# EAGLE design water (EAGLE 8.2.0)
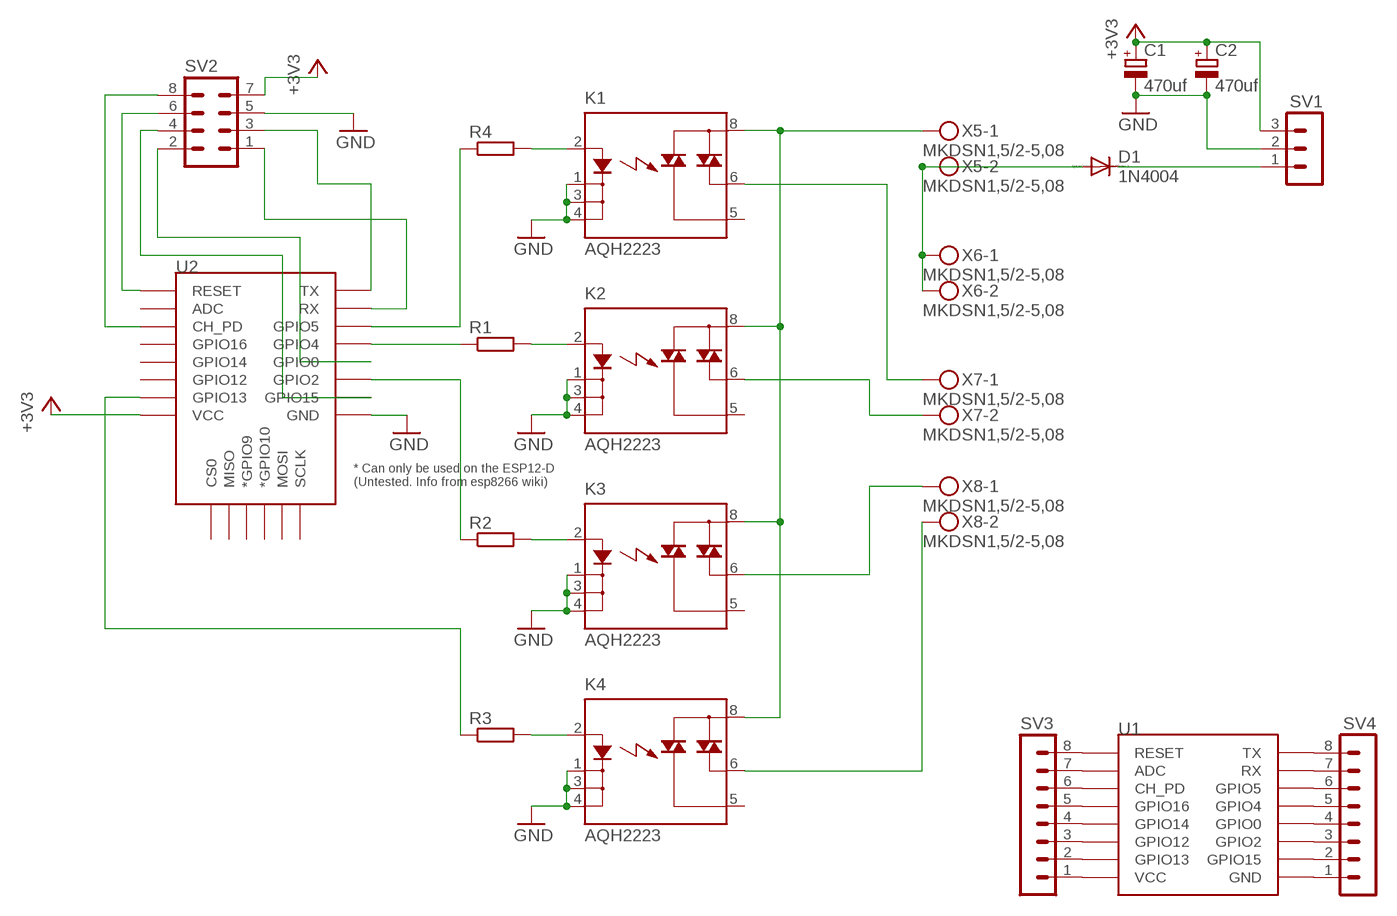
[diagram p0: schematic, sheet 1]

## Parts
C1  470uf  CPOL-EUE5-10.5  [E5-10,5]
C2  470uf  CPOL-EUE5-10.5  [E5-10,5]
D1  1N4004  [DO41-10]
K1  AQH2223  [DIL07]
K2  AQH2223  [DIL07]
K3  AQH2223  [DIL07]
K4  AQH2223  [DIL07]
R1  R-EU_R1206  [R1206]
R2  R-EU_R1206  [R1206]
R3  R-EU_R1206  [R1206]
R4  R-EU_R1206  [R1206]
SV1  MA03-1  [MA03-1]
SV2  MA04-2  [MA04-2]
SV3  MA08-1  [MA08-1]
SV4  MA08-1  [MA08-1]
U1  ESP12EPOGO  [ESP12E-POGO]
U2  ESP12ESMD  [ESP12E-SMD]
X5  MKDSN1,5/2-5,08  [MKDSN1,5/2-5,08]
X6  MKDSN1,5/2-5,08  [MKDSN1,5/2-5,08]
X7  MKDSN1,5/2-5,08  [MKDSN1,5/2-5,08]
X8  MKDSN1,5/2-5,08  [MKDSN1,5/2-5,08]

## Nets
+3V3: C1.+ C2.+ SV1.3 SV2.7 U2.VCC
GND: C1.- C2.- K1.1(K) K1.3(K1) K1.4(K2) K2.1(K) K2.3(K1) K2.4(K2) K3.1(K) K3.3(K1) K3.4(K2) K4.1(K) K4.3(K1) K4.4(K2) SV1.2 SV2.5 U2.GND
N$1: K1.2(A) R4.2
N$2: K2.2(A) R1.2
N$3: K3.2(A) R2.2
N$4: K4.2(A) R3.2
N$5: R4.1 U2.GPIO5
N$6: R1.1 U2.GPIO4
N$7: R2.1 U2.GPIO2
N$8: R3.1 U2.GPIO13
N$9: K4.6(DS3) X8.2
N$10: K3.6(DS3) X8.1
N$11: K2.6(DS3) X7.2
N$12: K1.6(DS3) X7.1
N$13: SV2.8 U2.CH_PD
N$14: D1.C SV1.1
N$15: D1.A X5.2 X6.1 X6.2
N$16: SV2.6 U2.RESET
N$17: SV2.3 U2.TXD0(TX)
N$18: SV2.1 U2.RXD0(RX)
N$19: SV2.4 U2.GPIO15
N$20: SV2.2 U2.GPIO0
N$21: K1.8(DS1) K2.8(DS1) K3.8(DS1) K4.8(DS1) X5.1
N$22: SV3.1 U1.VCC
N$23: SV3.2 U1.GPIO13
N$24: SV3.3 U1.GPIO12
N$25: SV3.4 U1.GPIO14
N$26: SV3.5 U1.GPIO16
N$27: SV3.6 U1.CH_PD
N$28: SV3.7 U1.ADC
N$29: SV3.8 U1.RESET
N$30: SV4.1 U1.GND
N$31: SV4.2 U1.GPIO15
N$32: SV4.3 U1.GPIO2
N$33: SV4.4 U1.GPIO0
N$34: SV4.5 U1.GPIO4
N$35: SV4.6 U1.GPIO5
N$36: SV4.7 U1.RXD0(RX)
N$37: SV4.8 U1.TXD0(TX)
Unconnected: K1.5(DS2) K2.5(DS2) K3.5(DS2) K4.5(DS2) U2.ADC U2.CS0 U2.GPIO9(*GPIO9) U2.GPIO10(*GPIO10) U2.GPIO12 U2.GPIO14 U2.GPIO16 U2.MISO U2.MOSI U2.SCLK

## Library data of the parts
C1 C2 = resistor:CPOL-EU: POLARIZED CAPACITOR, European symbol
D1 = diode:1N4004: DIODE general purpose rectifier, 1 A
K1-K4 = relay:AQH*223: SOLID STATE RELAY NAiS Source: http://www.mew-europe.com/.. en_ds_61613_0000.pdf; MF: AROMAT/ MATSUSHITA; MPN: AQH2223; OC_FARNELL: unknown; OC_NEWARK: 26K3059
R1-R4 = resistor:R-EU_: RESISTOR, European symbol
SV1 = con-lstb:MA03-1: PIN HEADER; OC_FARNELL: unknown; OC_NEWARK: unknown
SV2 = con-lstb:MA04-2: PIN HEADER; OC_FARNELL: unknown; OC_NEWARK: unknown
SV3 SV4 = con-lstb:MA08-1: PIN HEADER; OC_FARNELL: unknown; OC_NEWARK: unknown
U1 = my-parts:ESP12E: ESP12E Module
U2 = esp8266modules:ESP12E: ESP12E Module
X5-X8 = con-phoenix-508:MKDSN1,5/2-5,08: MKDSN 1,5/ 2-5,08 Printklemme Nennstrom: 13,5 A Nennspannung: 250 V Rastermaß: 5,08 mm Polzahl: 2 Anschlussart: Schraubanschluss Montage: Löten Anschlussrichtung Leiter/Platine: 0 ° Artikelnummer: 1729128 Source: http://eshop.phoenixcontact.com .. 1729128.pdf

## Board
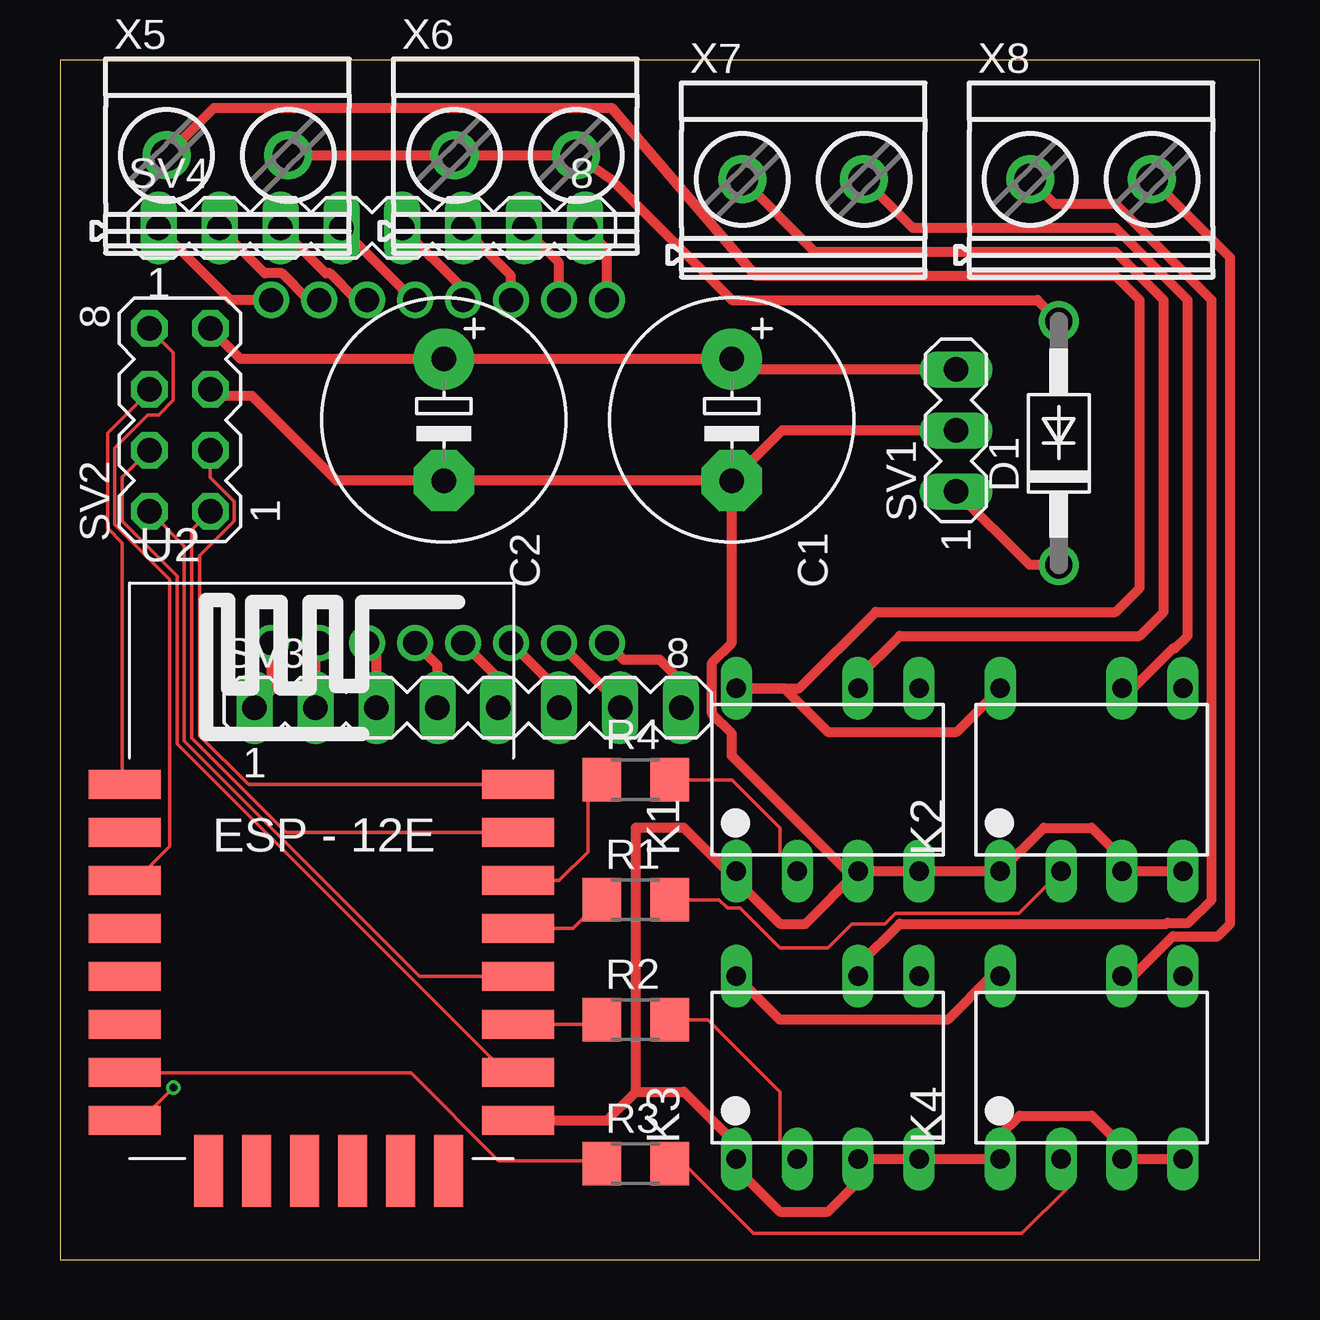
[diagram p1: board, top side]
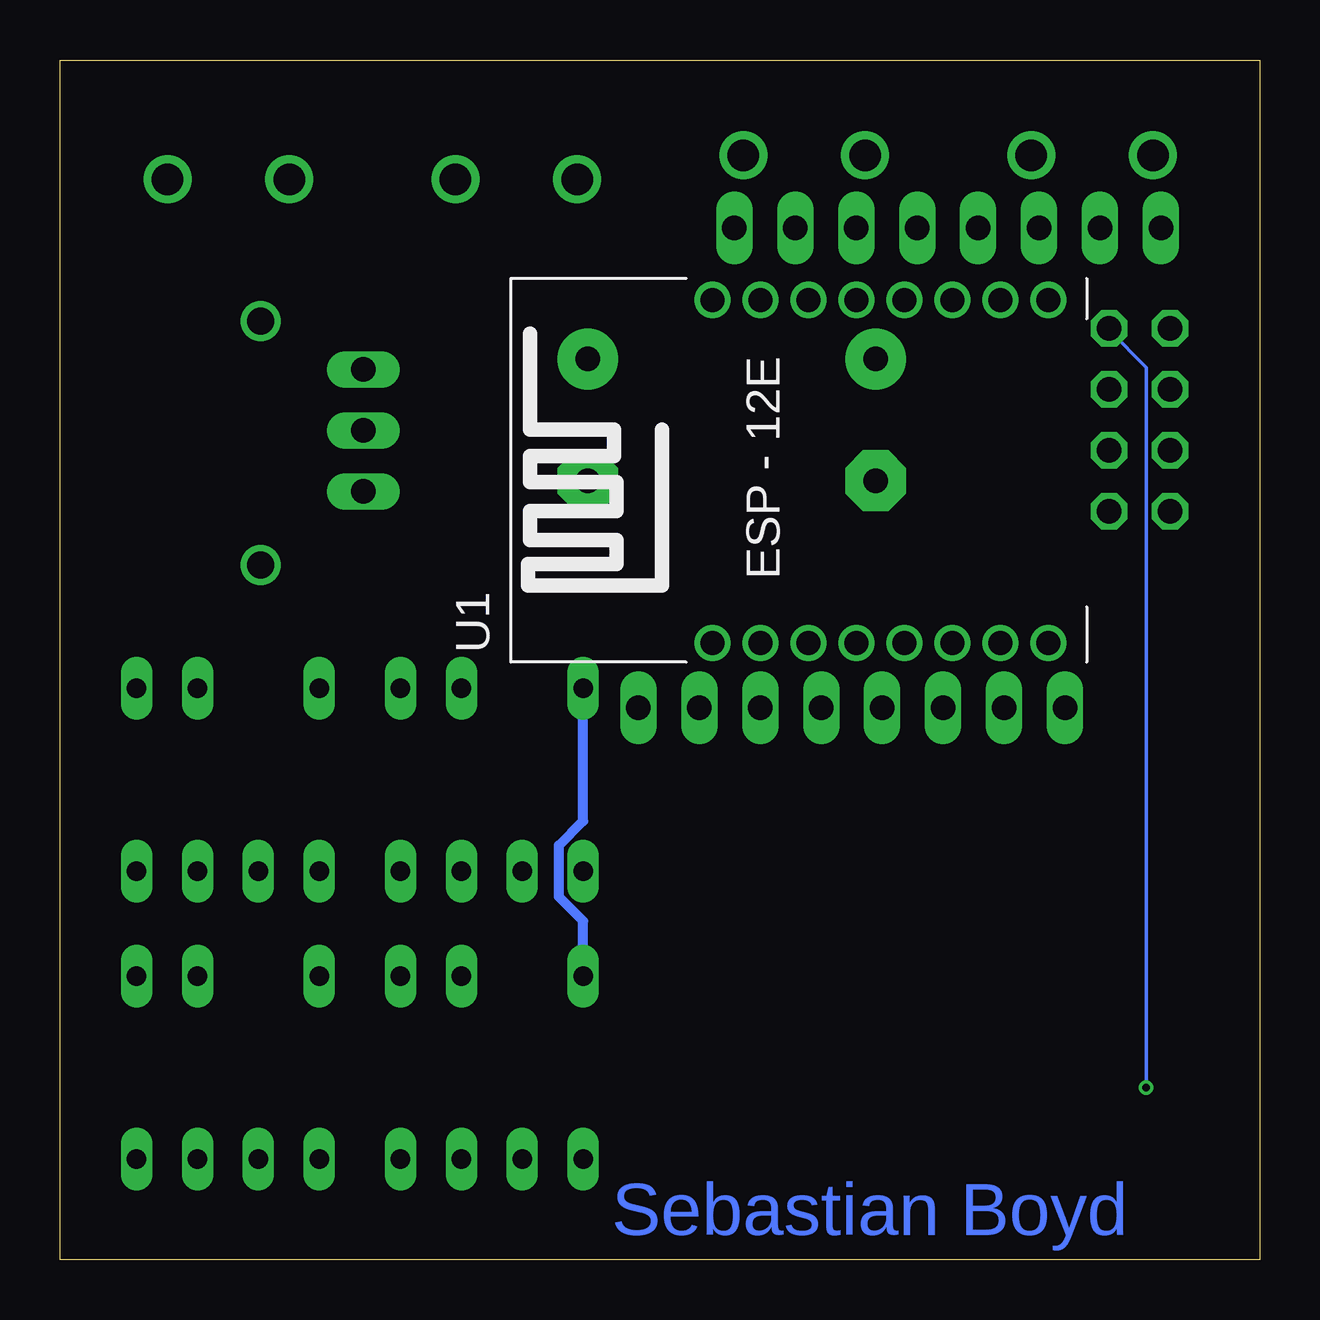
[diagram p2: board, bottom side, seen from below]

Size 50 x 50 mm. Coordinates in mm from the lower left corner, seen from the top.
Outline: 0,0 50,0 50,50 0,50 0,0
Copper layers (1*16): Top 0.035mm / dielectric 1.5mm / Bottom 0.035mm
Design rules "dirt_cheap_dirty_boards.v1": minimum track width 5mil, minimum drill 12mil, track to track 5mil, track to pad 5mil, pad to pad 5mil, via to via 5mil, smd to smd 0mil, copper to edge 10mil, drill to drill 10mil, minimum pad ring 10mil, minimum via ring 6mil, stop-mask expansion 2mil, vias tented up to drill 25mil, thermal gap 10mil

### Footprints (pad centres in the part's own frame; a part is rotated, then mirrored left to right if it is on the bottom)
E5-10,5 = drill 1.016 pad 2.54: + -2.54,0 | drill 1.016 pad 2.54 octagon: - 2.54,0
DO41-10 = drill 1.118: A 5.08,0; C -5.08,0
DIL07 = drill 0.8 long: 1 -3.81,-3.81; 2 -1.27,-3.81; 3 1.27,-3.81; 4 3.81,-3.81; 5 3.81,3.81; 6 1.27,3.81; 8 -3.81,3.81
R1206 = smd 1.6 x 1.803: 1 -1.422,0; 2 1.422,0
MA03-1 = drill 1.016 long: 1 -2.54,0; 2 0,0; 3 2.54,0
MA04-2 = drill 1.016 octagon: 1 -3.81,-1.27; 2 -3.81,1.27; 3 -1.27,-1.27; 4 -1.27,1.27; 5 1.27,-1.27; 6 1.27,1.27; 7 3.81,-1.27; 8 3.81,1.27
MA08-1 = drill 1.016 long: 1 -8.89,0; 2 -6.35,0; 3 -3.81,0; 4 -1.27,0; 5 1.27,0; 6 3.81,0; 7 6.35,0; 8 8.89,0
ESP12E-POGO = drill 1: ADC -7.3,3.8; CH_PD -7.3,1.8; GND 7,-8.2; GPIO0 7,-2.2; GPIO2 7,-4.2; GPIO4 7,-0.2; GPIO5 7,1.8; GPIO12 -7.3,-4.2; GPIO13 -7.3,-6.2; GPIO14 -7.3,-2.2; GPIO15 7,-6.2; GPIO16 -7.3,-0.2; RESET -7.3,5.8; RXD0 7,3.8; TXD0 7,5.8; VCC -7.3,-8.2
ESP12E-SMD = smd 3 x 1.2: ADC -8.3,3.8; CH_PD -8.3,1.8; GND 8.1,-8.2; GPIO0 8.1,-2.2; GPIO2 8.1,-4.2; GPIO4 8.1,-0.2; GPIO5 8.1,1.8; GPIO12 -8.3,-4.2; GPIO13 -8.3,-6.2; GPIO14 -8.3,-2.2; GPIO15 8.1,-6.2; GPIO16 -8.3,-0.2; RESET -8.3,5.8; RXD0 8.1,3.8; TXD0 8.1,5.8; VCC -8.3,-8.2 | smd 1.2 x 3: CS0 -4.8,-10.3; GPIO9 -0.8,-10.3; GPIO10 1.2,-10.3; MISO -2.8,-10.3; MOSI 3.2,-10.3; SCLK 5.2,-10.3
MKDSN1,5/2-5,08 = drill 1.3 pad 2: 1 -2.561,0.025; 2 2.519,0.025

### Placement (x,y rotation side)
C1  28,35 270 top
C2  16,35 270 top
D1  41.63,34.03 90 top
K1  32,20 0 top
K2  43,20 0 top
K3  32,8 0 top
K4  43,8 0 top
R1  24,15 0 top
R2  24,10 0 top
R3  24,4 0 top
R4  24,20 0 top
SV1  37.35,34.56 90 top
SV2  5,35 90 top
SV3  17,23 0 top
SV4  13,43 0 top
U1  17,33 90 bottom
U2  11,14 0 top
X5  7,46 0 top
X6  19,46 0 top
X7  31,45 0 top
X8  43,45 0 top

### Tracks (layer width: path | path; a pad name or v marks a point on that pad's centre or on a via)
+3V3  (via drill 0.3)
  Top 0.152: v4.72,7.16 3.5,5.94 2.74,5.94 U2.VCC
  Top 0.406: SV1.3 28.44,37.1 C1.+ C2.+ 7.54,37.54 SV2.7
  Bottom 0.152: v4.72,7.16 4.72,37.19 6.25,38.71 SV2.7
GND
  Top 0.406: K4.4 K4.3 44,4.46 44,5 43,6 40,6 39.19,5.19 K4.1 K3.4 K3.3 33,3.92 33,3 32,2 30,2 28.19,3.81 K3.1 28,4.38 28,5 26,7 24,7 | U2.GND 22.8,5.8 24,7 | 24,7 24,18 26,18 27.81,16.19 K1.1 28.19,15.81 30,14 31.08,14 K1.3 | K1.3 K1.4 K2.1 41,18 43,18 44,17 44,16.46 K2.3 K2.4 | SV1.2 30.1,34.56 C1.- | C1.- C2.- 11.54,32.46 8,36 6.54,36 SV2.5 | K1.3 32.81,16.19 31.15,17.85 28,21 28,21.92 27.18,22.74 27.18,24.88 28,25.7 C1.-
N$1
  Top 0.152: R4.2 28,20 30,18 30,16.92 K1.2
N$2
  Top 0.152: R1.2 27.48,15 27.82,14.65 28.35,14.65 30,13 32,13 33,14 34.39,14 34.82,14.43 39.97,14.43 K2.2
N$3
  Top 0.152: R2.2 27,10 30,7 30,4.92 K3.2
N$4
  Top 0.152: R3.2 26,4 28.91,1.09 40.09,1.09 42,3 42,3.92 K4.2
N$5
  Top 0.152: U2.GPIO5 20.8,15.8 22,17 22,19.42 R4.1
N$6
  Top 0.152: U2.GPIO4 21.38,13.8 R1.1
N$7
  Top 0.152: U2.GPIO2 22.38,9.8 R2.1
N$8
  Top 0.152: R3.1 22.55,4.12 18.29,4.12 14.63,7.77 2.74,7.77 U2.GPIO13
N$9
  Top 0.406: X8.2 48.78,41.76 48.78,14 48.25,13.47 46.39,13.47 44.73,11.81 K4.6
N$10
  Top 0.406: K3.6 33.27,12.27 35,14 46.13,14 46.16,14.03 47.03,14.03 48,15 48,40 44,44 41.46,44 X8.1
N$11
  Top 0.406: K2.6 44.73,23.81 46.39,25.47 46.47,25.47 47,26 47,40 44,43 35.54,43 X7.2
N$12
  Top 0.406: K1.6 33.27,24.27 35,26 45,26 46,27 46,40 44,42 31.46,42 X7.1
N$13
  Top 0.152: U2.CH_PD 2.74,15.85 3.2,15.85 4.57,17.22 4.57,28.35 2.29,30.63 2.29,33.83 3.66,35.2 4.12,35.2 4.72,35.81 4.72,37.8 3.81,38.71 SV2.8
N$14
  Top 0.406: D1.C 40.42,28.95 SV1.1
N$15
  Top 0.406: X5.2 X6.1 X6.2 22.98,45.02 28,40 40.74,40 D1.A
N$16
  Top 0.152: U2.RESET 2.59,19.81 2.59,29.87 1.98,30.48 1.98,34.44 3.66,36.12 SV2.6
N$17
  Top 0.152: U2.TXD0 7.86,19.8 5.83,21.83 5.83,29.35 7.26,30.78 7.26,31.6 6.27,32.59 SV2.3
N$18
  Top 0.152: U2.RXD0 9.43,17.8 5.49,21.74 5.49,30.41 SV2.1
N$19
  Top 0.152: U2.GPIO15 19.05,7.92 18.44,7.92 4.88,21.49 4.88,28.5 2.59,30.79 2.59,32.61 3.66,33.68 SV2.4
N$20
  Top 0.152: 18.44,11.89 19.05,11.89 U2.GPIO0 15,11.8 5.18,21.61 5.18,29.74 SV2.2
N$21
  Top 0.406: K2.8 37.38,22 32,22 30.19,23.81 K1.8 30.81,23.81 34,27 44,27 45,28 45,40 44,41 29,41 23,48 6.41,48 X5.1 | K4.8 38.81,11.81 37,10 30,10 K3.8
  Bottom 0.406: K3.8 28.19,14.11 29.2,15.12 29.2,17.26 28.19,18.27 K1.8
N$22
  Top 0.406: U1.VCC 8.8,23.69 SV3.1
N$23
  Top 0.406: SV3.2 10.65,25.55 U1.GPIO13
N$24
  Top 0.406: SV3.3 13.19,25.31 U1.GPIO12
N$25
  Top 0.406: SV3.4 15.73,24.77 U1.GPIO14
N$26
  Top 0.406: SV3.5 18.27,24.23 U1.GPIO16
N$27
  Top 0.406: SV3.6 20.81,23.69 U1.CH_PD
N$28
  Top 0.406: SV3.7 23.35,23.15 U1.ADC
N$29
  Top 0.406: SV3.8 25.89,24.11 25,25 23.5,25 U1.RESET
N$30
  Top 0.406: U1.GND 7.11,40 SV4.1
N$31
  Top 0.406: SV4.2 8.54,41.11 9.26,41.11 10.37,40 U1.GPIO15
N$32
  Top 0.406: SV4.3 11.08,41.11 11.26,41.11 12.37,40 U1.GPIO2
N$33
  Top 0.406: U1.GPIO0 14.73,40 SV4.4
N$34
  Top 0.406: U1.GPIO4 16.8,40.47 SV4.5
N$35
  Top 0.406: U1.GPIO5 18.8,41.01 SV4.6
N$36
  Top 0.406: U1.RXD0 20.8,41.55 SV4.7
N$37
  Top 0.406: U1.TXD0 22.8,42.09 SV4.8

### Text on the board
Bottom: Sebastian Boyd
bStop: Sebastian Boyd